# EAGLE design Mutli-Stepper-Driver (EAGLE 7.2.0)

## Sheet 1 of 5
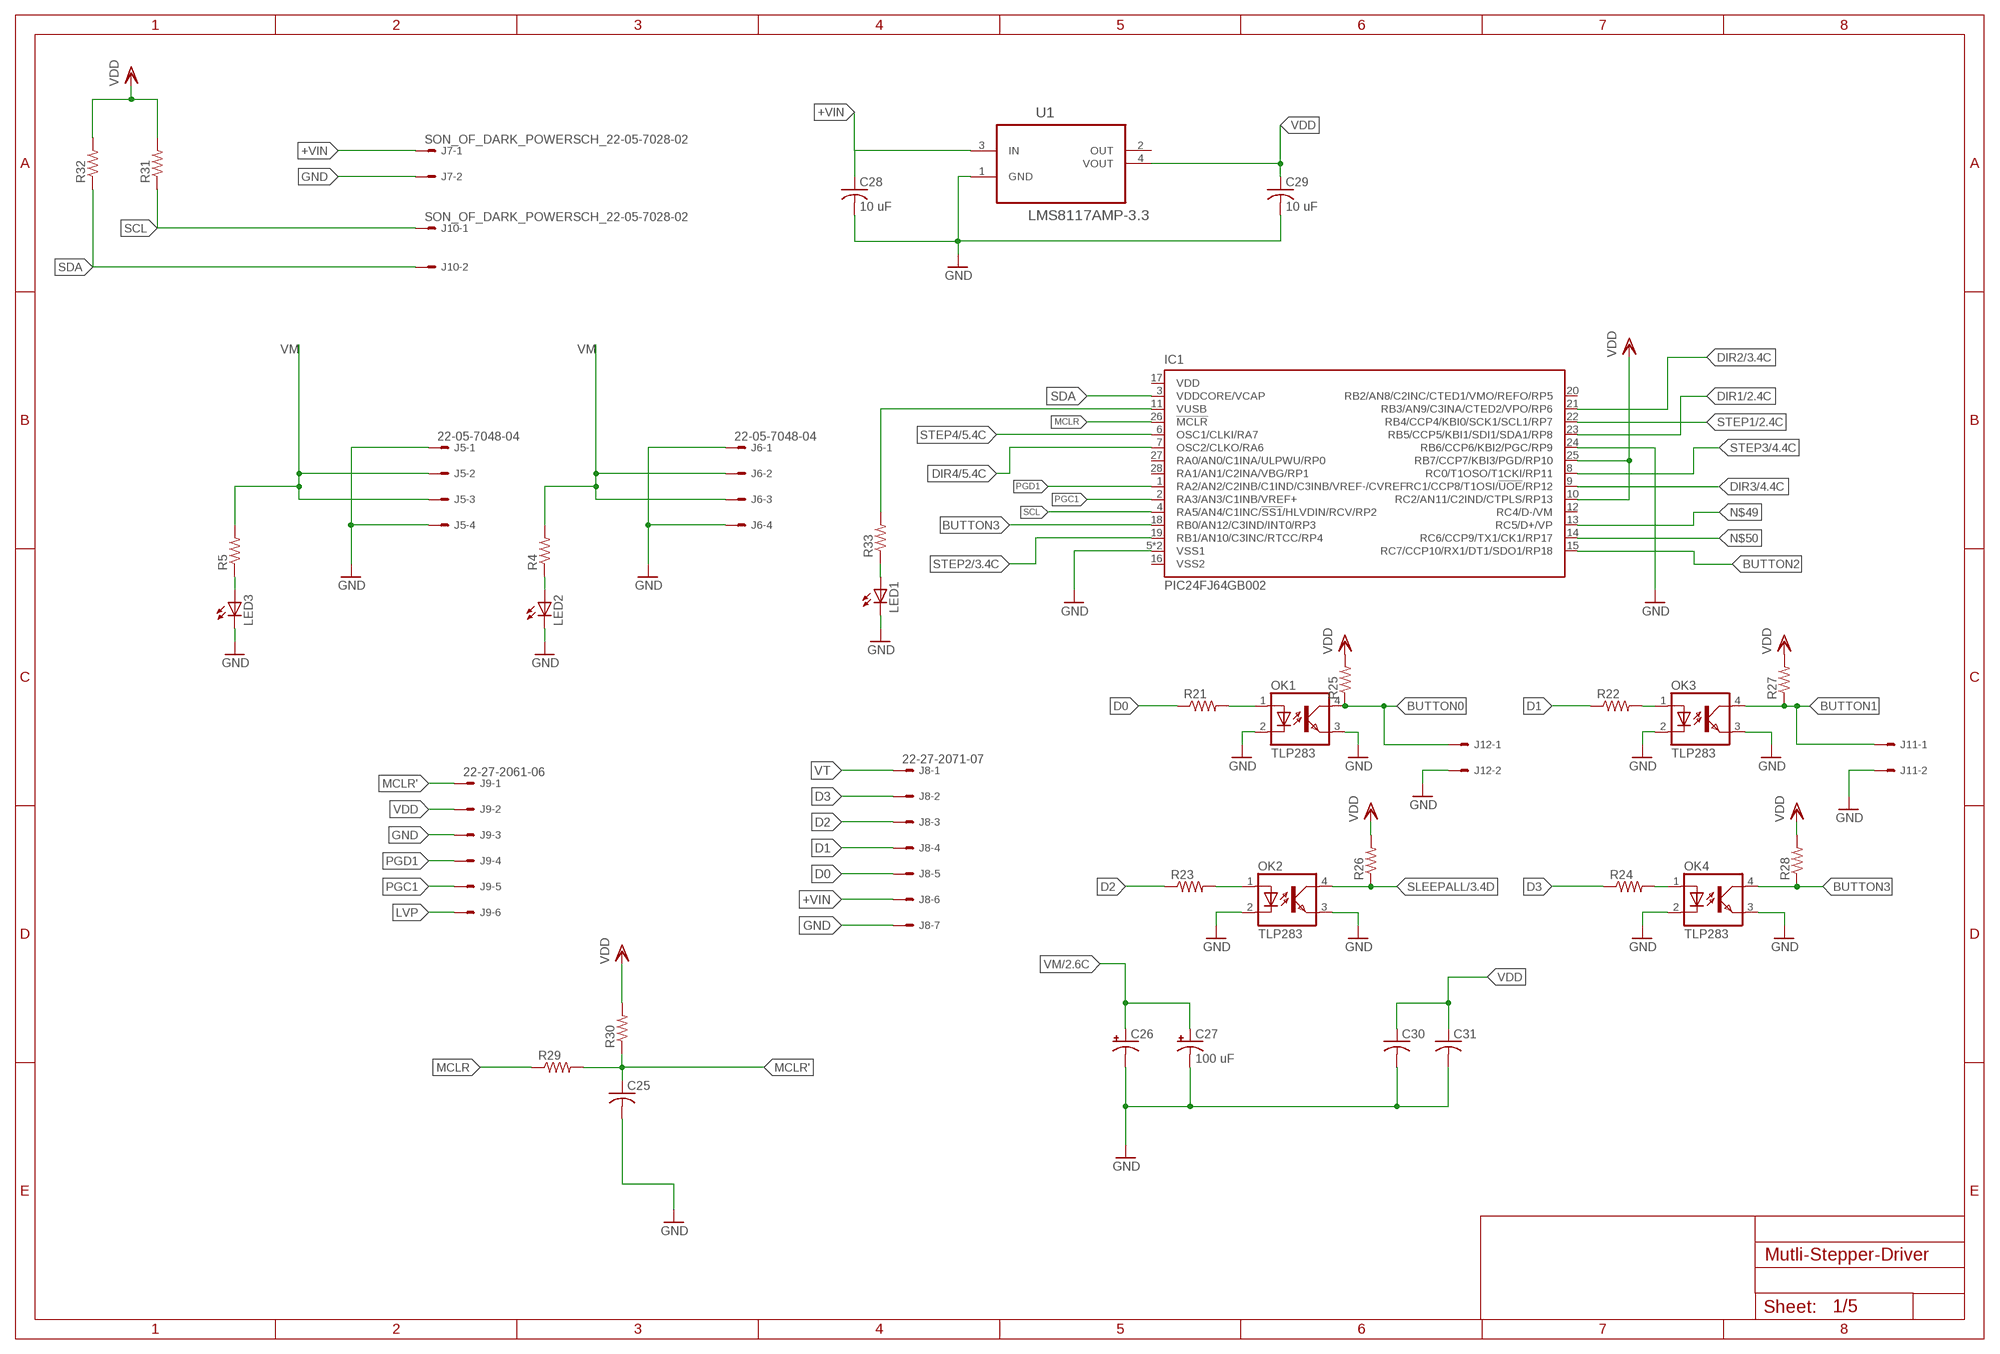
[diagram p0: schematic, sheet 1]

### Parts
C25  C-USC0805  [C0805]
C26  CPOL-USCT7343  [CT7343]
C27  100 uF  CPOL-USCT7343  [CT7343]
C28  10 uF  C-USC3216  [C3216]
C29  10 uF  C-USC3216  [C3216]
C30  C-USC0805  [C0805]
C31  C-USC0805  [C0805]
IC1  PIC24FJ64GB002  MICROCHIP_PIC18F2J53ML  [MICROCHIP_QFN28-ML_6X6MM]
J5  22-05-7048-04  [7395-04]
J6  22-05-7048-04  [7395-04]
J7  SON_OF_DARK_POWERSCH_22-05-7028-02  [SON_OF_DARK_POWERSCH_7395-02]
J8  22-27-2071-07  [6410-07]
J9  22-27-2061-06  [6410-06]
J10  SON_OF_DARK_POWERSCH_22-05-7028-02  [SON_OF_DARK_POWERSCH_7395-02]
J11  SON_OF_DARK_POWERSCH_22-05-7028-02  [SON_OF_DARK_POWERSCH_7395-02]
J12  SON_OF_DARK_POWERSCH_22-05-7028-02  [SON_OF_DARK_POWERSCH_7395-02]
LED1  LEDCHIPLED_0805  [CHIPLED_0805]
LED2  LEDCHIPLED_0805  [CHIPLED_0805]
LED3  LEDCHIPLED_0805  [CHIPLED_0805]
OK1  TLP283  [MINI-FLAT-4]
OK2  TLP283  [MINI-FLAT-4]
OK3  TLP283  [MINI-FLAT-4]
OK4  TLP283  [MINI-FLAT-4]
R4  R-US_R0805  [R0805]
R5  R-US_R0805  [R0805]
R21  R-US_R0805  [R0805]
R22  R-US_R0805  [R0805]
R23  R-US_R0805  [R0805]
R24  R-US_R0805  [R0805]
R25  R-US_R0805  [R0805]
R26  R-US_R0805  [R0805]
R27  R-US_R0805  [R0805]
R28  R-US_R0805  [R0805]
R29  R-US_R0805  [R0805]
R30  R-US_R0805  [R0805]
R31  R-US_R0805  [R0805]
R32  R-US_R0805  [R0805]
R33  R-US_R0805  [R0805]
U1  LMS8117AMP-3.3  NSC-LMS8117AMP_LMS8117AMP-3.3  [NSC-LMS8117AMP_SOT230P696X180-4N]

### Nets
+VIN: C28.1 J7.1 J8.6 U1.3(IN)
BUTTON0: J12.1 OK1.4(COL) R25.1
BUTTON1: J11.1 OK3.4(COL) R27.1
BUTTON2: IC1.15(RC7/CCP10/RX1/DT1/SDO1/RP18)
BUTTON3: IC1.18(RB0/AN12/C3IND/INT0/RP3) OK4.4(COL) R28.1
D0: J8.5 R21.1
D1: J8.4 R22.1
D2: J8.3 R23.1
D3: J8.2 R24.1
DIR1: IC1.23(RB5/CCP5/KBI1/SDI1/SDA1/RP8) ; also sheet 2
DIR2: IC1.21(RB3/AN9/C3INA/CTED2/VPO/RP6) ; also sheet 3
DIR3: IC1.9(RC1/CCP8/T1OSI/!UOE!/RP12) ; also sheet 4
DIR4: IC1.7(OSC2/CLKO/RA6) ; also sheet 5
GND: C25.2 C26.- C27.- C28.2 C29.2 C30.2 C31.2 IC1.5(VSS1) IC1.24(RB6/CCP6/KBI2/PGC/RP9) IC1.EXP(VSS1) J5.1 J5.4 J6.1 J6.4 J7.2 J8.7 J9.3 J11.2 J12.2 LED1.C LED2.C LED3.C OK1.2(C) OK1.3(EMIT) OK2.2(C) OK2.3(EMIT) OK3.2(C) OK3.3(EMIT) OK4.2(C) OK4.3(EMIT) U1.1(GND) ; also sheet 2,3,4,5
LVP: J9.6
MCLR: IC1.26(!MCLR) R29.1
MCLR': C25.1 J9.1 R29.2 R30.1
N$2: LED2.A R4.1
N$12: LED3.A R5.1
N$37: OK2.1(A) R23.2
N$40: OK4.1(A) R24.2
N$42: LED1.A R33.1
N$43: OK1.1(A) R21.2
N$47: OK3.1(A) R22.2
N$48: IC1.11(VUSB) R33.2
N$49: IC1.13(RC5/D+/VP)
N$50: IC1.14(RC6/CCP9/TX1/CK1/RP17)
PGC1: IC1.2(RA3/AN3/C1INB/VREF+) J9.5
PGD1: IC1.1(RA2/AN2/C2INB/C1IND/C3INB/VREF-/CVREF) J9.4
SCL: IC1.4(RA5/AN4/C1INC/!SS1!/HLVDIN/RCV/RP2) J10.1 R31.1
SDA: IC1.3(VDDCORE/VCAP) J10.2 R32.1
SLEEPALL: OK2.4(COL) R26.1 ; also sheet 2,3,4,5
STEP1: IC1.22(RB4/CCP4/KBI0/SCK1/SCL1/RP7) ; also sheet 2
STEP2: IC1.19(RB1/AN10/C3INC/RTCC/RP4) ; also sheet 3
STEP3: IC1.8(RC0/T1OSO/T1CKI/RP11) ; also sheet 4
STEP4: IC1.6(OSC1/CLKI/RA7) ; also sheet 5
VDD: C29.1 C30.1 C31.1 IC1.10(RC2/AN11/C2IND/CTPLS/RP13) IC1.25(RB7/CCP7/KBI3/PGD/RP10) J9.2 R25.2 R26.2 R27.2 R28.2 R30.2 R31.2 R32.2 U1.4(VOUT)
VM: C26.+ C27.+ J5.2 J5.3 J6.2 J6.3 R4.2 R5.2 ; also sheet 2,3,4,5
VT: J8.1
Unconnected: IC1.12(RC4/D-/VM) IC1.16(VSS2) IC1.17(VDD) IC1.20(RB2/AN8/C2INC/CTED1/VMO/REFO/RP5) IC1.27(RA0/AN0/C1INA/ULPWU/RP0) IC1.28(RA1/AN1/C2INA/VBG/RP1) U1.2(OUT)

## Sheet 2 of 5
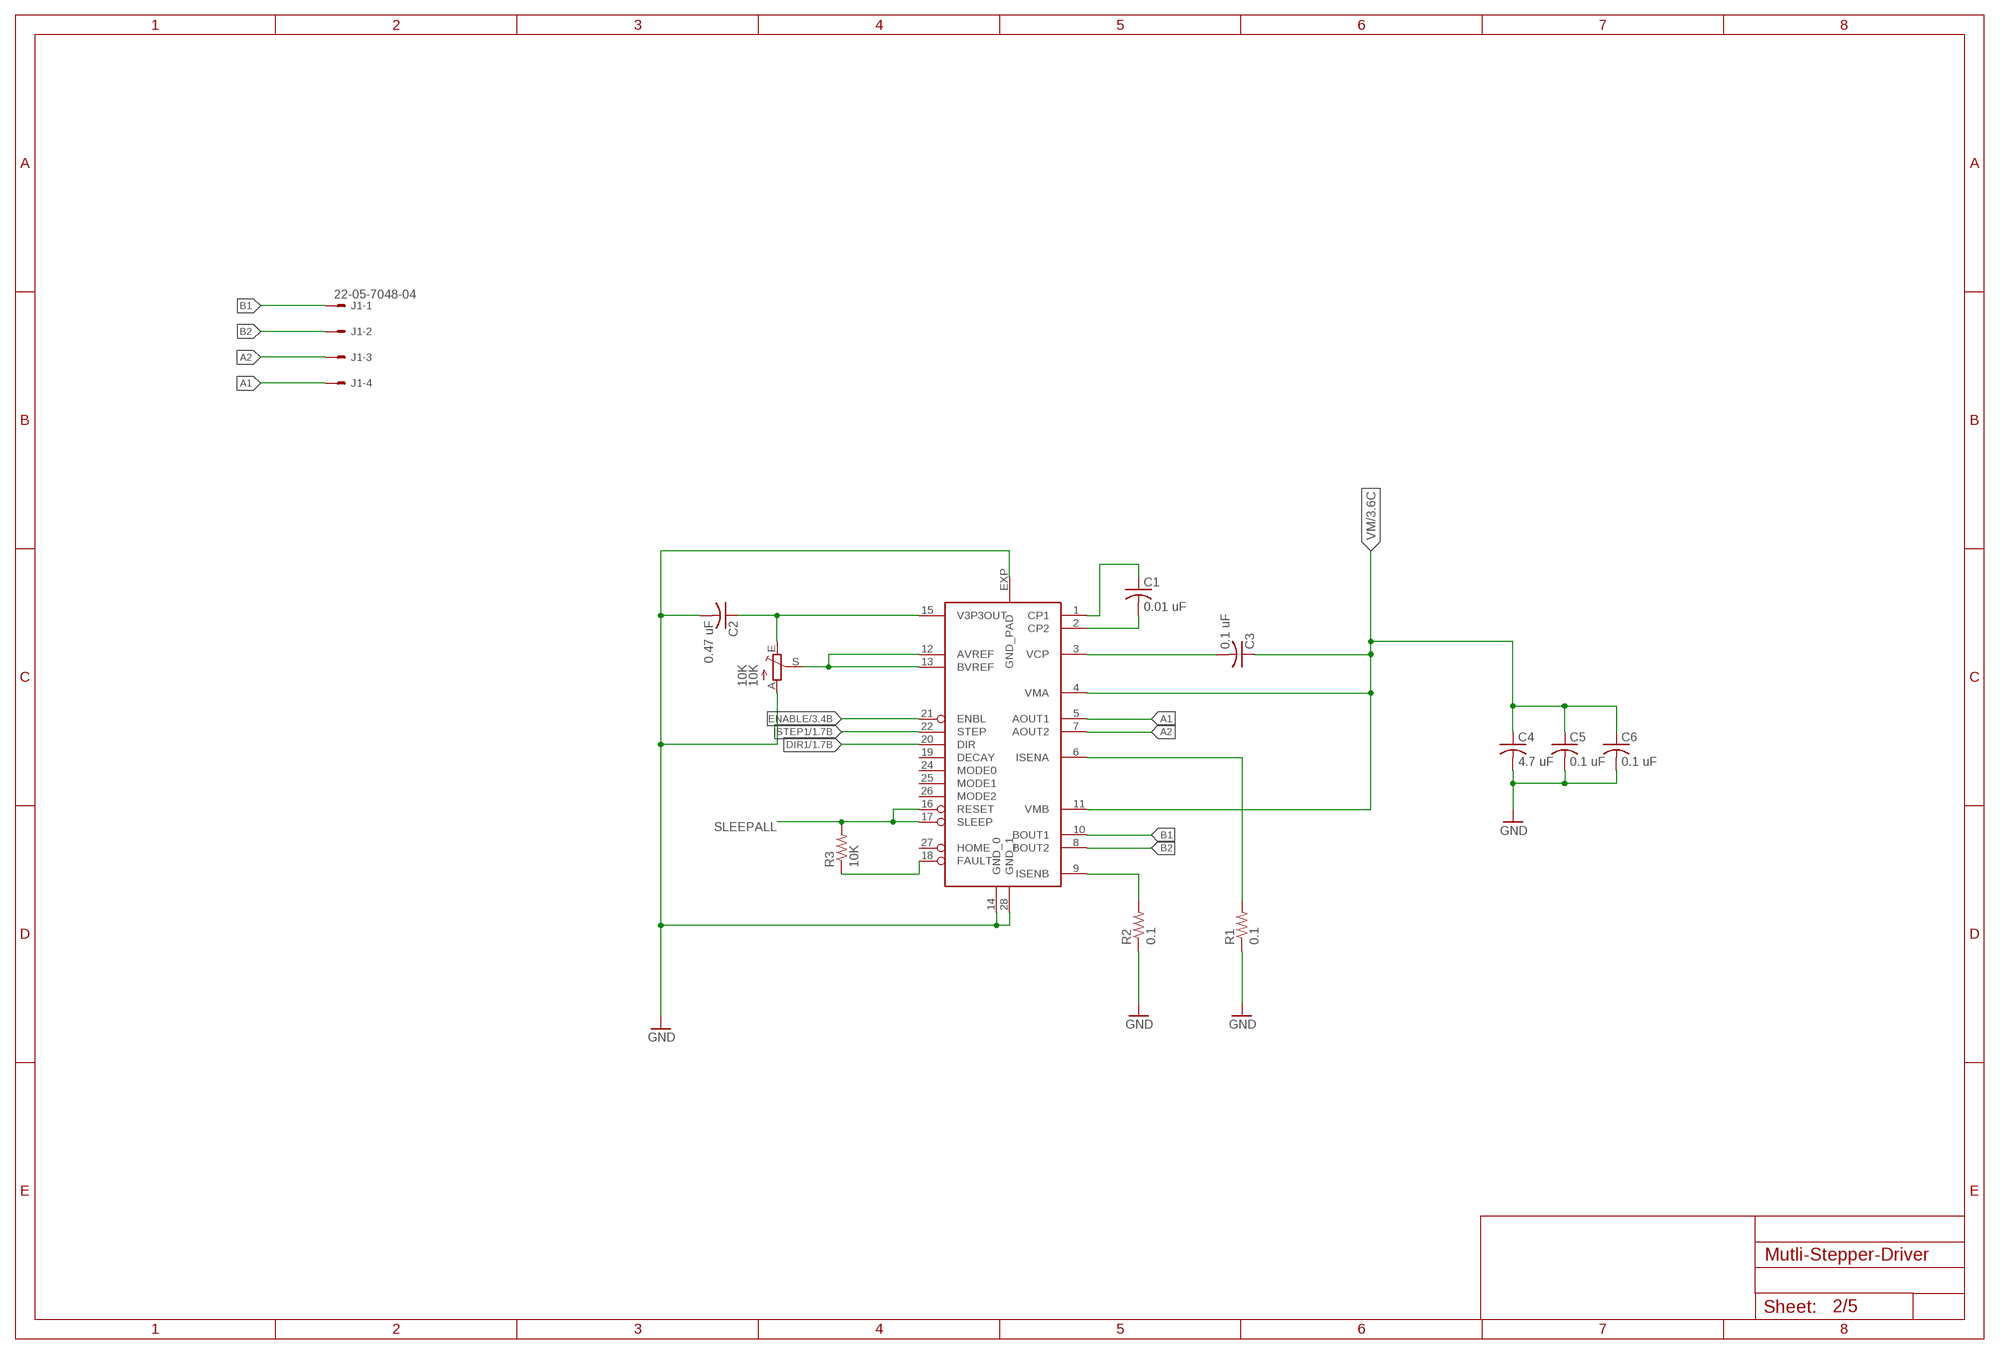
[diagram p1: schematic, sheet 2]

### Parts
10K  10K  TRIM_EU-CT6  [CT6]
C1  0.01 uF  C-USC0805  [C0805]
C2  0.47 uF  C-USC0805  [C0805]
C3  0.1 uF  C-USC0805  [C0805]
C4  4.7 uF  C-USC0805  [C0805]
C5  0.1 uF  C-USC0805  [C0805]
C6  0.1 uF  C-USC0805  [C0805]
J1  22-05-7048-04  [7395-04]
R1  0.1  R-US_R1206  [R1206]
R2  0.1  R-US_R1206  [R1206]
R3  10K  R-US_R0805  [R0805]
U$1  DRV8825PWP  [TSSOP-28]

### Nets
A1: J1.4 U$1.5(AOUT1)
A2: J1.3 U$1.7(AOUT2)
B1: J1.1 U$1.10(BOUT1)
B2: J1.2 U$1.8(BOUT2)
DIR1: U$1.20(DIR) ; also sheet 1
ENABLE: U$1.21(ENBL) ; also sheet 3,4,5
FAULT1: R3.1 U$1.18(FAULT)
GND: 10K.A C2.2 C4.2 C5.2 C6.2 R1.1 R2.1 U$1.14(GND_0) U$1.28(GND_1) U$1.EXP(GND_PAD) ; also sheet 1,3,4,5
N$1: C3.2 U$1.3(VCP)
N$9: R1.2 U$1.6(ISENA)
N$10: R2.2 U$1.9(ISENB)
N$11: 10K.S U$1.12(AVREF) U$1.13(BVREF)
N$15: 10K.E C2.1 U$1.15(V3P3OUT)
N$16: C1.1 U$1.1(CP1)
N$17: C1.2 U$1.2(CP2)
SLEEPALL: R3.2 U$1.16(RESET) U$1.17(SLEEP) ; also sheet 1,3,4,5
STEP1: U$1.22(STEP) ; also sheet 1
VM: C3.1 C4.1 C5.1 C6.1 U$1.4(VMA) U$1.11(VMB) ; also sheet 1,3,4,5
Unconnected: U$1.19(DECAY) U$1.24(MODE0) U$1.25(MODE1) U$1.26(MODE2) U$1.27(HOME)

## Sheet 3 of 5
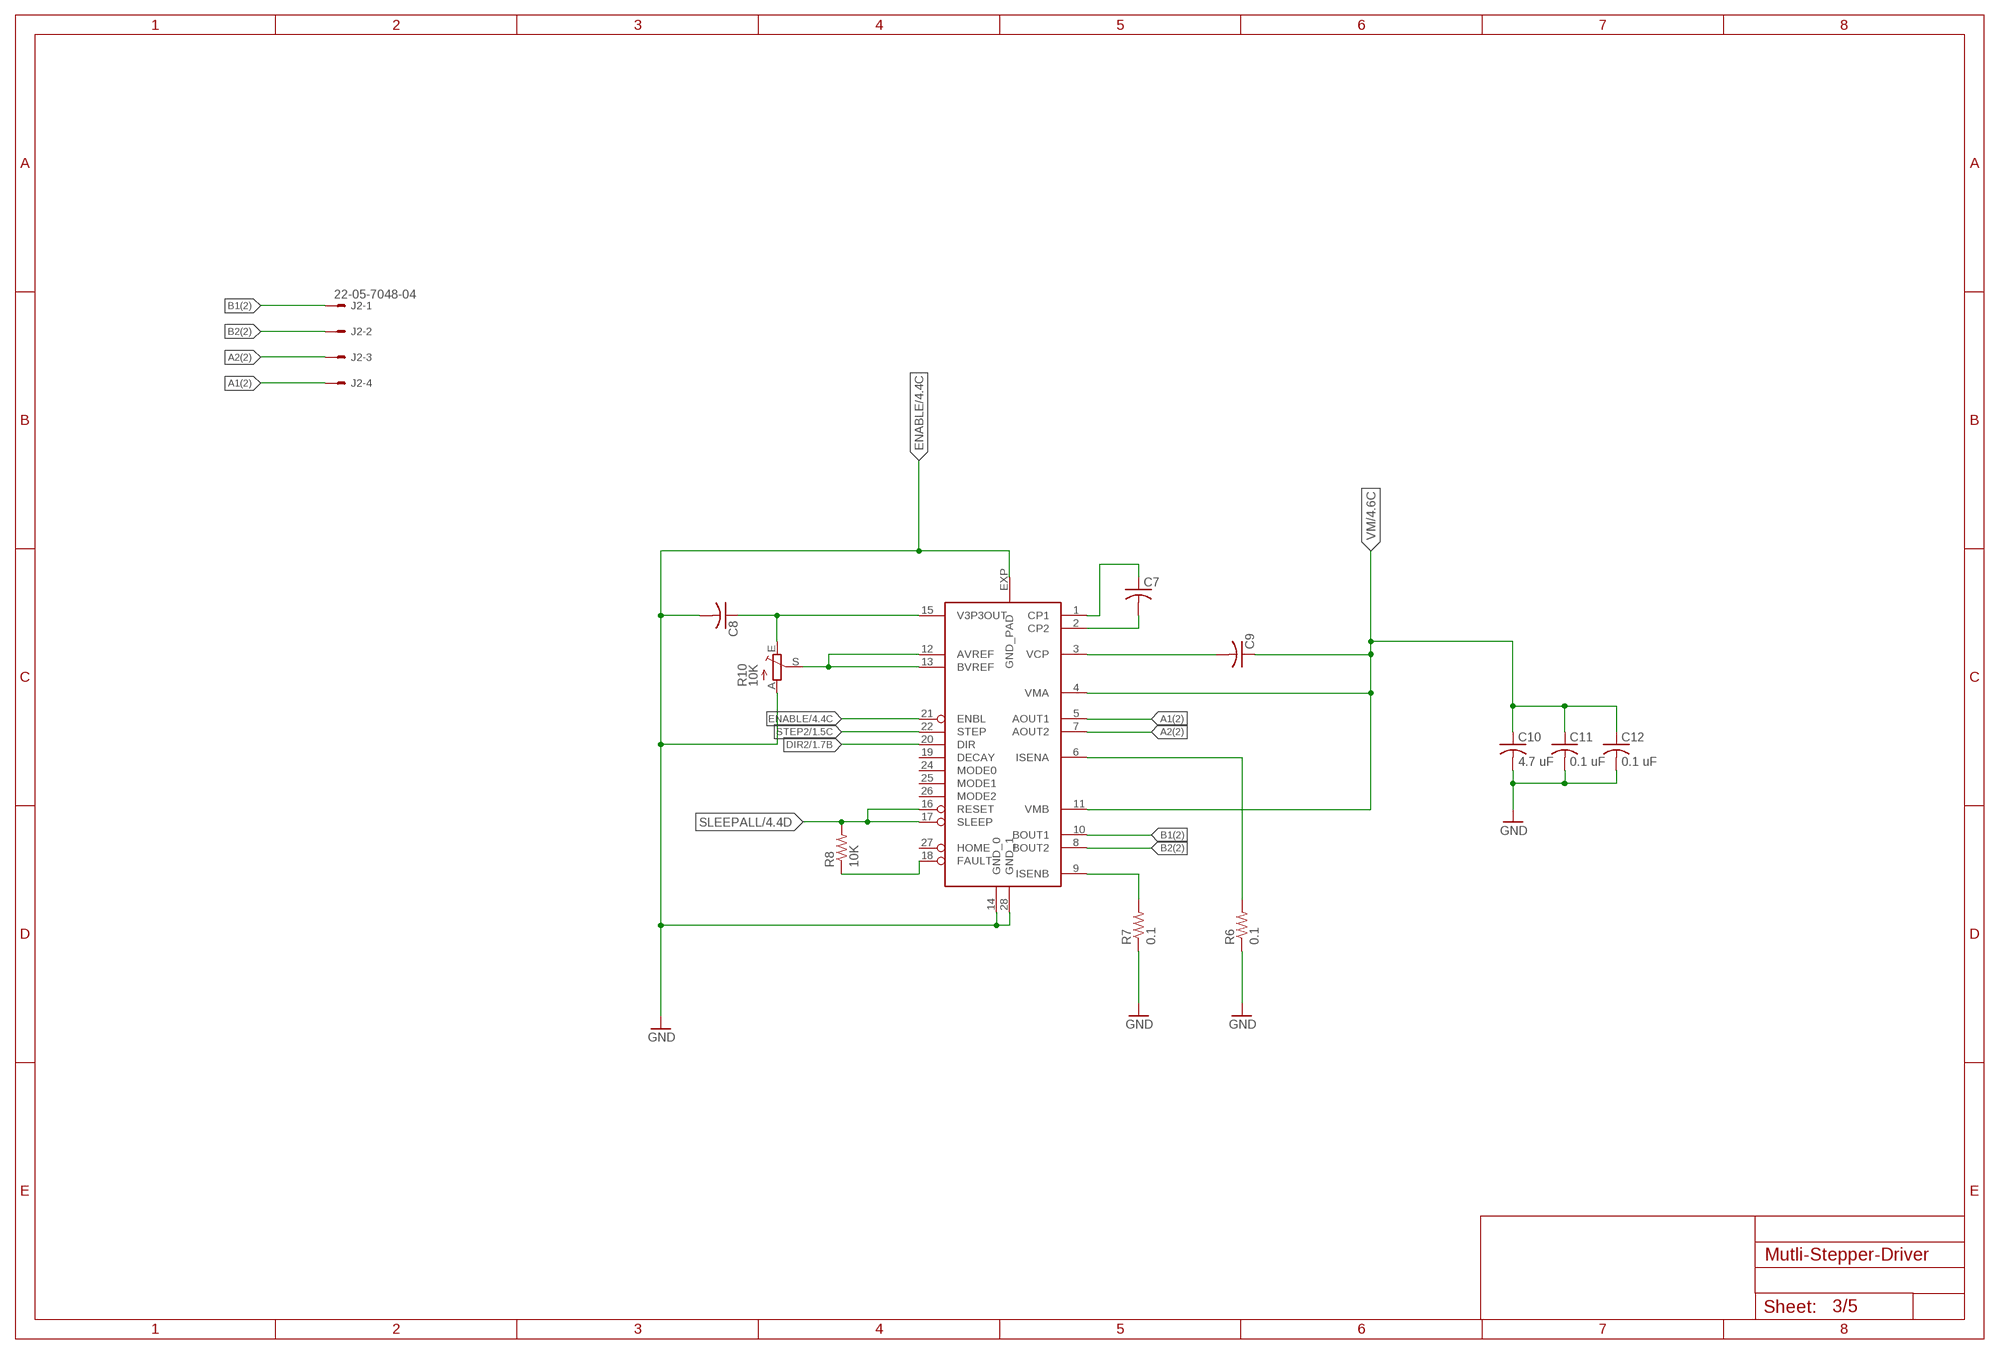
[diagram p2: schematic, sheet 3]

### Parts
C7  C-USC0805  [C0805]
C8  C-USC0805  [C0805]
C9  C-USC0805  [C0805]
C10  4.7 uF  C-USC0805  [C0805]
C11  0.1 uF  C-USC0805  [C0805]
C12  0.1 uF  C-USC0805  [C0805]
J2  22-05-7048-04  [7395-04]
R6  0.1  R-US_R1206  [R1206]
R7  0.1  R-US_R1206  [R1206]
R8  10K  R-US_R0805  [R0805]
R10  10K  TRIM_EU-CT6  [CT6]
U$2  DRV8825PWP  [TSSOP-28]

### Nets
A1(2): J2.4 U$2.5(AOUT1)
A2(2): J2.3 U$2.7(AOUT2)
B1(2): J2.1 U$2.10(BOUT1)
B2(2): J2.2 U$2.8(BOUT2)
DIR2: U$2.20(DIR) ; also sheet 1
ENABLE: C8.2 R10.A U$2.14(GND_0) U$2.21(ENBL) U$2.28(GND_1) U$2.EXP(GND_PAD) ; supply symbol labelled GND ; also sheet 2,4,5
FAULT2: R8.1 U$2.18(FAULT)
GND: C10.2 C11.2 C12.2 R6.1 R7.1 ; also sheet 1,2,4,5
N$3: R6.2 U$2.6(ISENA)
N$5: R7.2 U$2.9(ISENB)
N$6: C8.1 R10.E U$2.15(V3P3OUT)
N$7: C7.1 U$2.1(CP1)
N$8: C7.2 U$2.2(CP2)
N$14: C9.2 U$2.3(VCP)
N$18: R10.S U$2.12(AVREF) U$2.13(BVREF)
SLEEPALL: R8.2 U$2.16(RESET) U$2.17(SLEEP) ; also sheet 1,2,4,5
STEP2: U$2.22(STEP) ; also sheet 1
VM: C9.1 C10.1 C11.1 C12.1 U$2.4(VMA) U$2.11(VMB) ; also sheet 1,2,4,5
Unconnected: U$2.19(DECAY) U$2.24(MODE0) U$2.25(MODE1) U$2.26(MODE2) U$2.27(HOME)

## Sheet 4 of 5
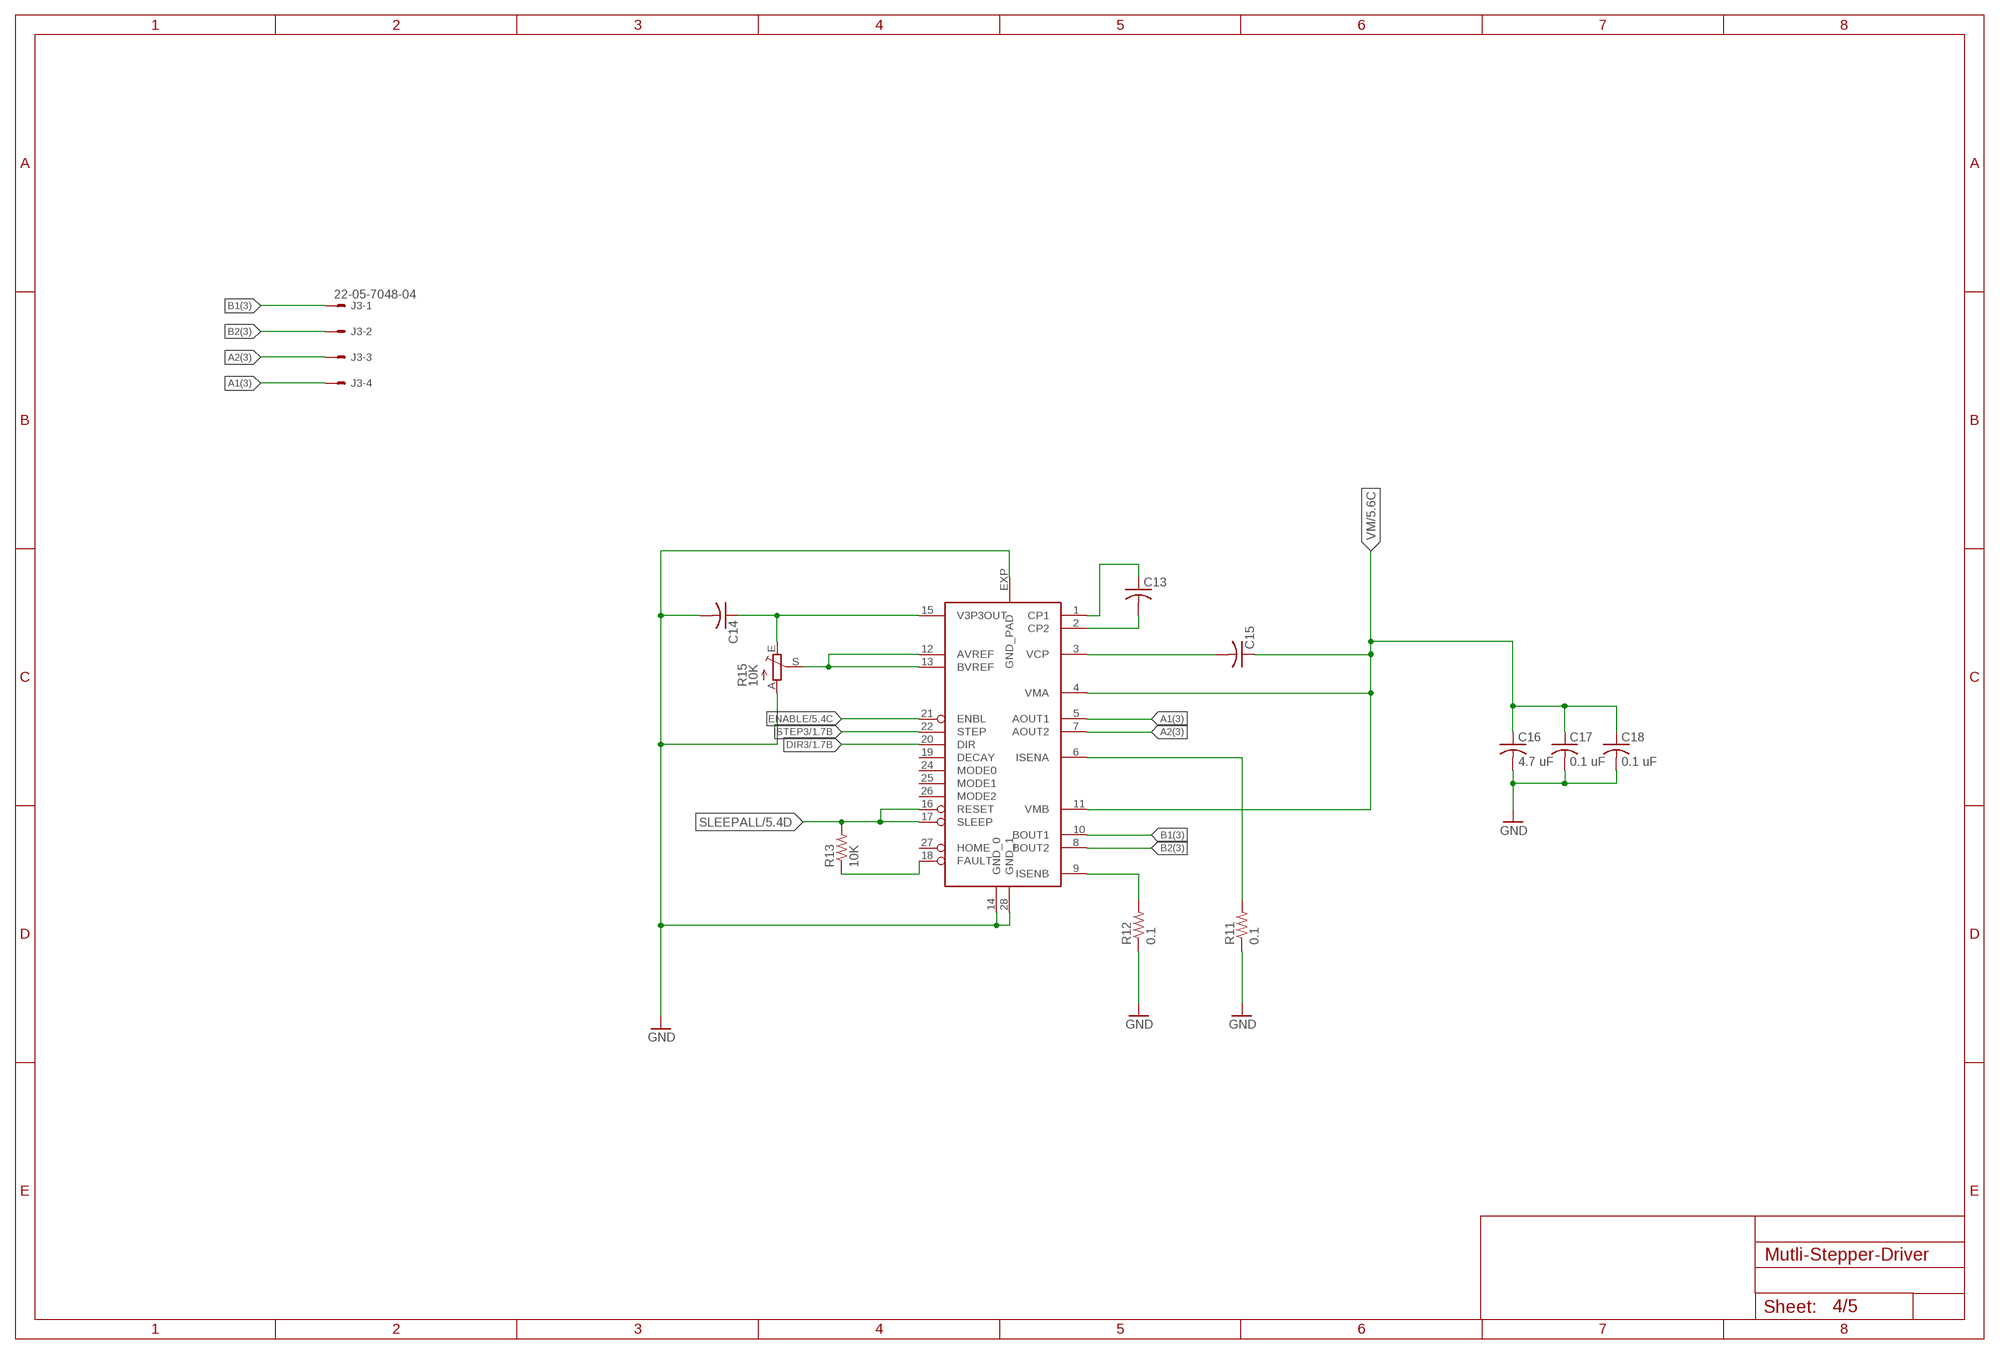
[diagram p3: schematic, sheet 4]

### Parts
C13  C-USC0805  [C0805]
C14  C-USC0805  [C0805]
C15  C-USC0805  [C0805]
C16  4.7 uF  C-USC0805  [C0805]
C17  0.1 uF  C-USC0805  [C0805]
C18  0.1 uF  C-USC0805  [C0805]
J3  22-05-7048-04  [7395-04]
R11  0.1  R-US_R1206  [R1206]
R12  0.1  R-US_R1206  [R1206]
R13  10K  R-US_R0805  [R0805]
R15  10K  TRIM_EU-CT6  [CT6]
U$3  DRV8825PWP  [TSSOP-28]

### Nets
A1(3): J3.4 U$3.5(AOUT1)
A2(3): J3.3 U$3.7(AOUT2)
B1(3): J3.1 U$3.10(BOUT1)
B2(3): J3.2 U$3.8(BOUT2)
DIR3: U$3.20(DIR) ; also sheet 1
ENABLE: U$3.21(ENBL) ; also sheet 2,3,5
FAULT3: R13.1 U$3.18(FAULT)
GND: C14.2 C16.2 C17.2 C18.2 R11.1 R12.1 R15.A U$3.14(GND_0) U$3.28(GND_1) U$3.EXP(GND_PAD) ; also sheet 1,2,3,5
N$19: R11.2 U$3.6(ISENA)
N$20: R12.2 U$3.9(ISENB)
N$21: C14.1 R15.E U$3.15(V3P3OUT)
N$22: C13.1 U$3.1(CP1)
N$23: C13.2 U$3.2(CP2)
N$26: C15.2 U$3.3(VCP)
N$27: R15.S U$3.12(AVREF) U$3.13(BVREF)
SLEEPALL: R13.2 U$3.16(RESET) U$3.17(SLEEP) ; also sheet 1,2,3,5
STEP3: U$3.22(STEP) ; also sheet 1
VM: C15.1 C16.1 C17.1 C18.1 U$3.4(VMA) U$3.11(VMB) ; also sheet 1,2,3,5
Unconnected: U$3.19(DECAY) U$3.24(MODE0) U$3.25(MODE1) U$3.26(MODE2) U$3.27(HOME)

## Sheet 5 of 5
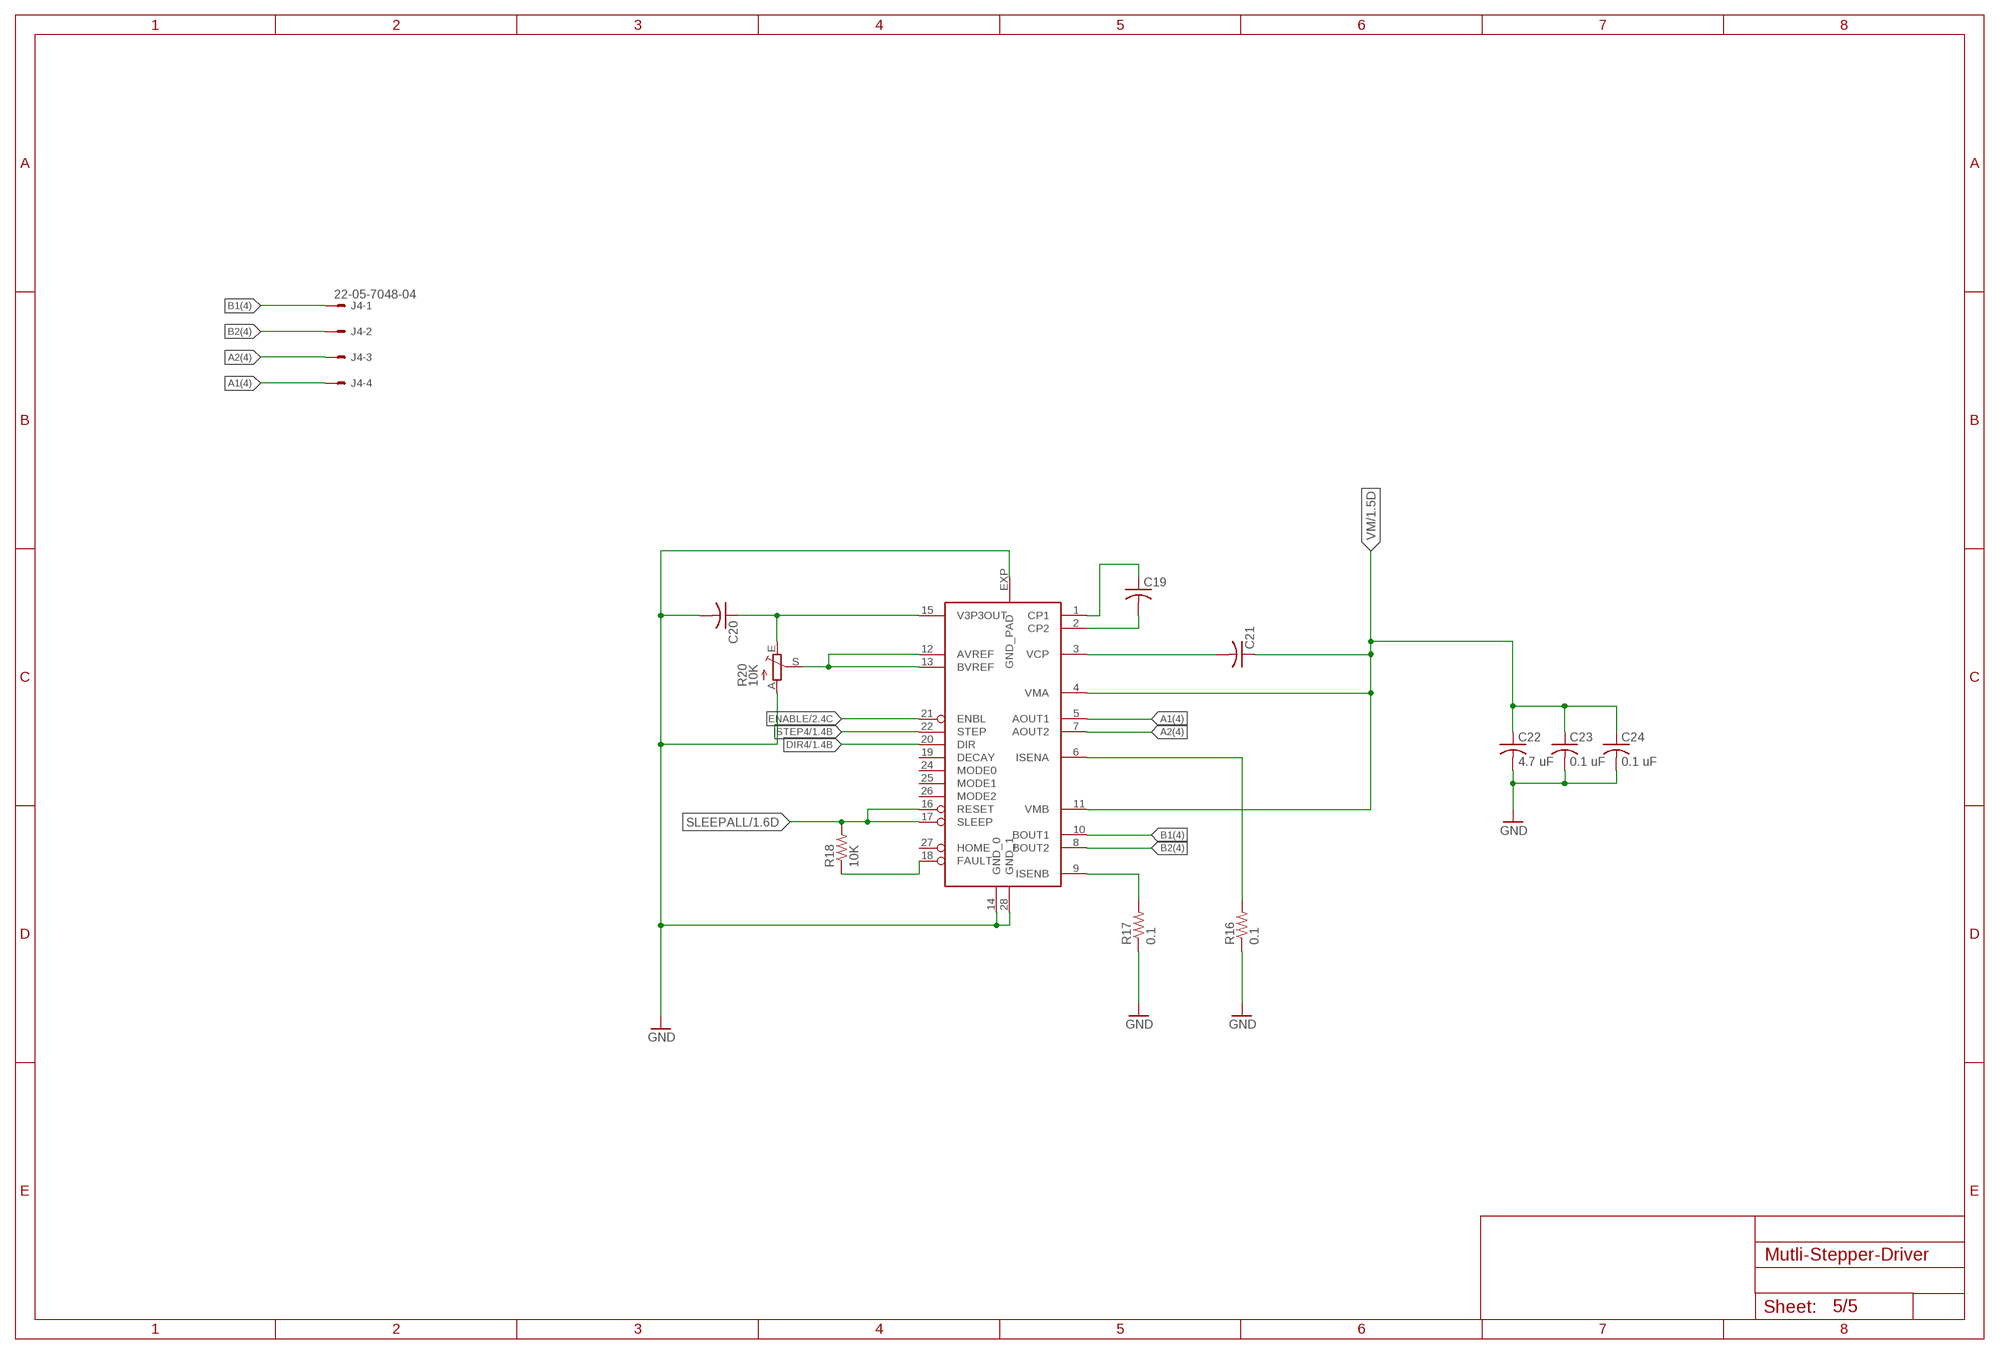
[diagram p4: schematic, sheet 5]

### Parts
C19  C-USC0805  [C0805]
C20  C-USC0805  [C0805]
C21  C-USC0805  [C0805]
C22  4.7 uF  C-USC0805  [C0805]
C23  0.1 uF  C-USC0805  [C0805]
C24  0.1 uF  C-USC0805  [C0805]
J4  22-05-7048-04  [7395-04]
R16  0.1  R-US_R1206  [R1206]
R17  0.1  R-US_R1206  [R1206]
R18  10K  R-US_R0805  [R0805]
R20  10K  TRIM_EU-CT6  [CT6]
U$4  DRV8825PWP  [TSSOP-28]

### Nets
A1(4): J4.4 U$4.5(AOUT1)
A2(4): J4.3 U$4.7(AOUT2)
B1(4): J4.1 U$4.10(BOUT1)
B2(4): J4.2 U$4.8(BOUT2)
DIR4: U$4.20(DIR) ; also sheet 1
ENABLE: U$4.21(ENBL) ; also sheet 2,3,4
FAULT4: R18.1 U$4.18(FAULT)
GND: C20.2 C22.2 C23.2 C24.2 R16.1 R17.1 R20.A U$4.14(GND_0) U$4.28(GND_1) U$4.EXP(GND_PAD) ; also sheet 1,2,3,4
N$28: R16.2 U$4.6(ISENA)
N$29: R17.2 U$4.9(ISENB)
N$30: C20.1 R20.E U$4.15(V3P3OUT)
N$31: C19.1 U$4.1(CP1)
N$32: C19.2 U$4.2(CP2)
N$35: C21.2 U$4.3(VCP)
N$36: R20.S U$4.12(AVREF) U$4.13(BVREF)
SLEEPALL: R18.2 U$4.16(RESET) U$4.17(SLEEP) ; also sheet 1,2,3,4
STEP4: U$4.22(STEP) ; also sheet 1
VM: C21.1 C22.1 C23.1 C24.1 U$4.4(VMA) U$4.11(VMB) ; also sheet 1,2,3,4
Unconnected: U$4.19(DECAY) U$4.24(MODE0) U$4.25(MODE1) U$4.26(MODE2) U$4.27(HOME)

## Library data of the parts
10K R10 R15 R20 = pot:TRIM_EU-: POTENTIOMETER
C1-C25 C28-C31 = rcl:C-US: CAPACITOR, American symbol
C26 C27 = rcl:CPOL-US: POLARIZED CAPACITOR, American symbol
IC1 = MotherboardRev2:MICROCHIP_PIC18F2*J53: PIC18F47J53 Family High-Performance USB Microcontrollers with nanoWatt XLP Technology Source: Data sheet <http://ww1.microchip.com/downloads/en/DeviceDoc/39964B.pdf>
J1-J6 = Son_of_Dark_Power:22-?-04: CONNECTOR wire to board 2.54 mm (.1 inch) pitch header; OC_FARNELL: unknown; OC_NEWARK: unknown
J7 J10-J12 = MotherboardRev2:SON_OF_DARK_POWERSCH_22-?-02: CONNECTOR wire to board 2.54 mm (.1 inch) pitch header; OC_FARNELL: 9731601; OC_NEWARK: unknown
J8 = con-molex:22-?-07: CONNECTOR wire to board 2.54 mm (.1 inch) pitch header; OC_FARNELL: unknown; OC_NEWARK: unknown
J9 = con-molex:22-?-06: CONNECTOR wire to board 2.54 mm (.1 inch) pitch header; OC_FARNELL: unknown; OC_NEWARK: unknown
LED1-LED3 = led:LED: LED OSRAM: - CHIPLED LG R971, LG N971, LY N971, LG Q971, LY Q971, LO R971, LY R971 LH N974, LH R974 LS Q976, LO Q976, LY Q976 LO Q996 - Hyper CHIPLED LW Q18S LB Q993, LB Q99A, LB R99A - SideLED LS A670, LO A670, LY A670, LG A670, LP A670 LB A673, LV A673, LT A673, LW A673 LH A674 LY A675 LS A676, LA A676, LO A676, LY A676, LW A676 LS A679, LY A679, LG A679 - Hyper Micro SIDELED® LS Y876, LA Y876, LO Y876, LY Y876 LT Y87S - SmartLED LW L88C, LW L88S LB L89C, LB L89S, LG L890 LS L89K, LO L89K, LY L89K LS L896, LA L896, LO L896, LY L896 - TOPLED LS T670, LO T670, LY T670, LG T670, LP T670 LSG T670, LSP T670, LSY T670, LOP T670, LYG T670 LG T671, LOG T671, LSG T671 LB T673, LV T673, LT T673, LW T673 LH T674 LS T676, LA T676, LO T676, LY T676, LB T676, LH T676, LSB T676, LW T676 LB T67C, LV T67C, LT T67C, LS T67K, LO T67K, LY T67K, LW E67C LS E67B, LA E67B, LO E67B, LY E67B, LB E67C, LV E67C, LT E67C LW T67C LS T679, LY T679, LG T679 LS T770, LO T770, LY T770, LG T770, LP T770 LB T773, LV T773, LT T773, LW T773 LH T774 LS E675, LA E675, LY E675, LS T675 LS T776, LA T776, LO T776, LY T776, LB T776 LHGB T686 LT T68C, LB T68C - Hyper Mini TOPLED® LB M676 - Mini TOPLED Santana® LG M470 LS M47K, LO M47K, LY M47K Source: http://www.osram.convergy.de LUXEON: - LUMILED® LXK2-PW12-R00, LXK2-PW12-S00, LXK2-PW14-U00, LXK2-PW14-V00 LXK2-PM12-R00, LXK2-PM12-S00, LXK2-PM14-U00 LXK2-PE12-Q00, LXK2-PE12-R00, LXK2-PE12-S00, LXK2-PE14-T00, LXK2-PE14-U00 LXK2-PB12-K00, LXK2-PB12-L00, LXK2-PB12-M00, LXK2-PB14-N00, LXK2-PB14-P00, LXK2-PB14-Q00 LXK2-PR12-L00, LXK2-PR12-M00, LXK2-PR14-Q00, LXK2-PR14-R00 LXK2-PD12-Q00, LXK2-PD12-R00, LXK2-PD12-S00 LXK2-PH12-R00, LXK2-PH12-S00 LXK2-PL12-P00, LXK2-PL12-Q00, LXK2-PL12-R00 Source: www.luxeon.com KINGBRIGHT: KA-3528ASYC Source: www.kingbright.com
OK1-OK4 = optocoupler:TLP283: TOSHIBA PHOTOCOUPLER GaAs IRED & PHOTO-TRANSISTOR Source: http://www.semicon.toshiba.co.jp/td/en/Opto/Photocoupler/en_20050928_TLP283_datasheet.pdf; OC_FARNELL: unknown; OC_NEWARK: unknown
R1-R8 R11-R13 R16-R18 R21-R33 = rcl:R-US_: RESISTOR, American symbol
U1 = MotherboardRev2:NSC-LMS8117AMP_LMS8117AMP-3.3: Low-Dropout Linear Regulator; MPN: LMS8117AMP-3.3; OC_FARNELL: 1469032; OC_NEWARK: 41K3020; PACKAGE: SOT-223-3; SUPPLIER: National Semiconductor
U$1-U$4 = drv88xx:DRV8825PWP

## Board
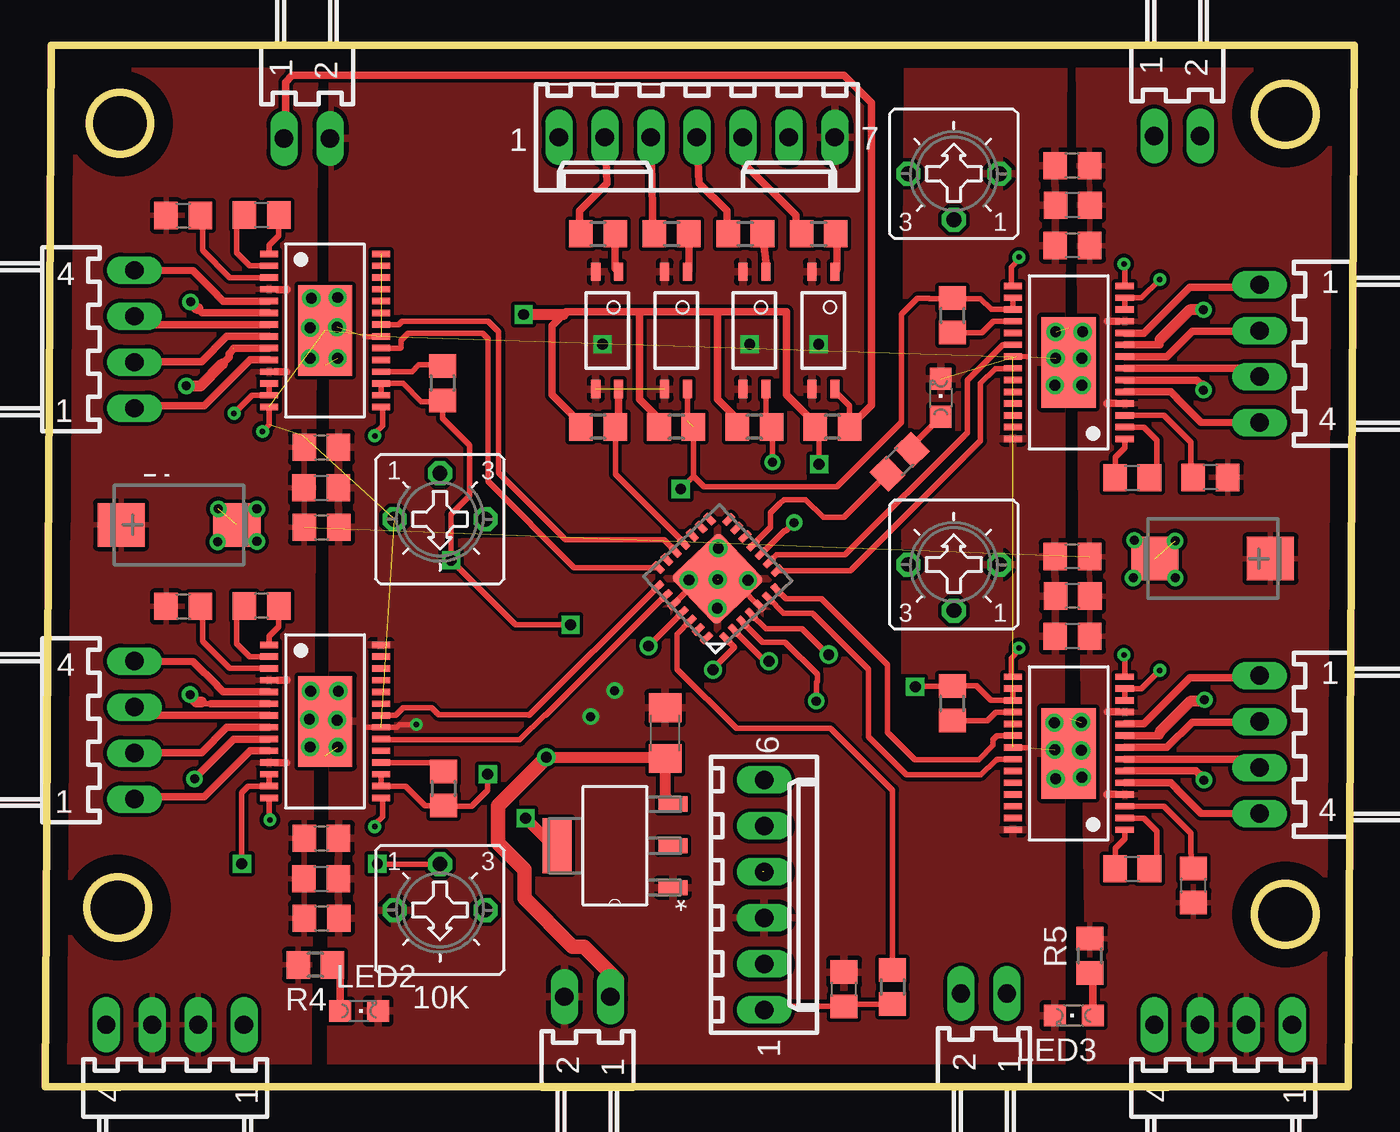
[diagram p5: board, top side]
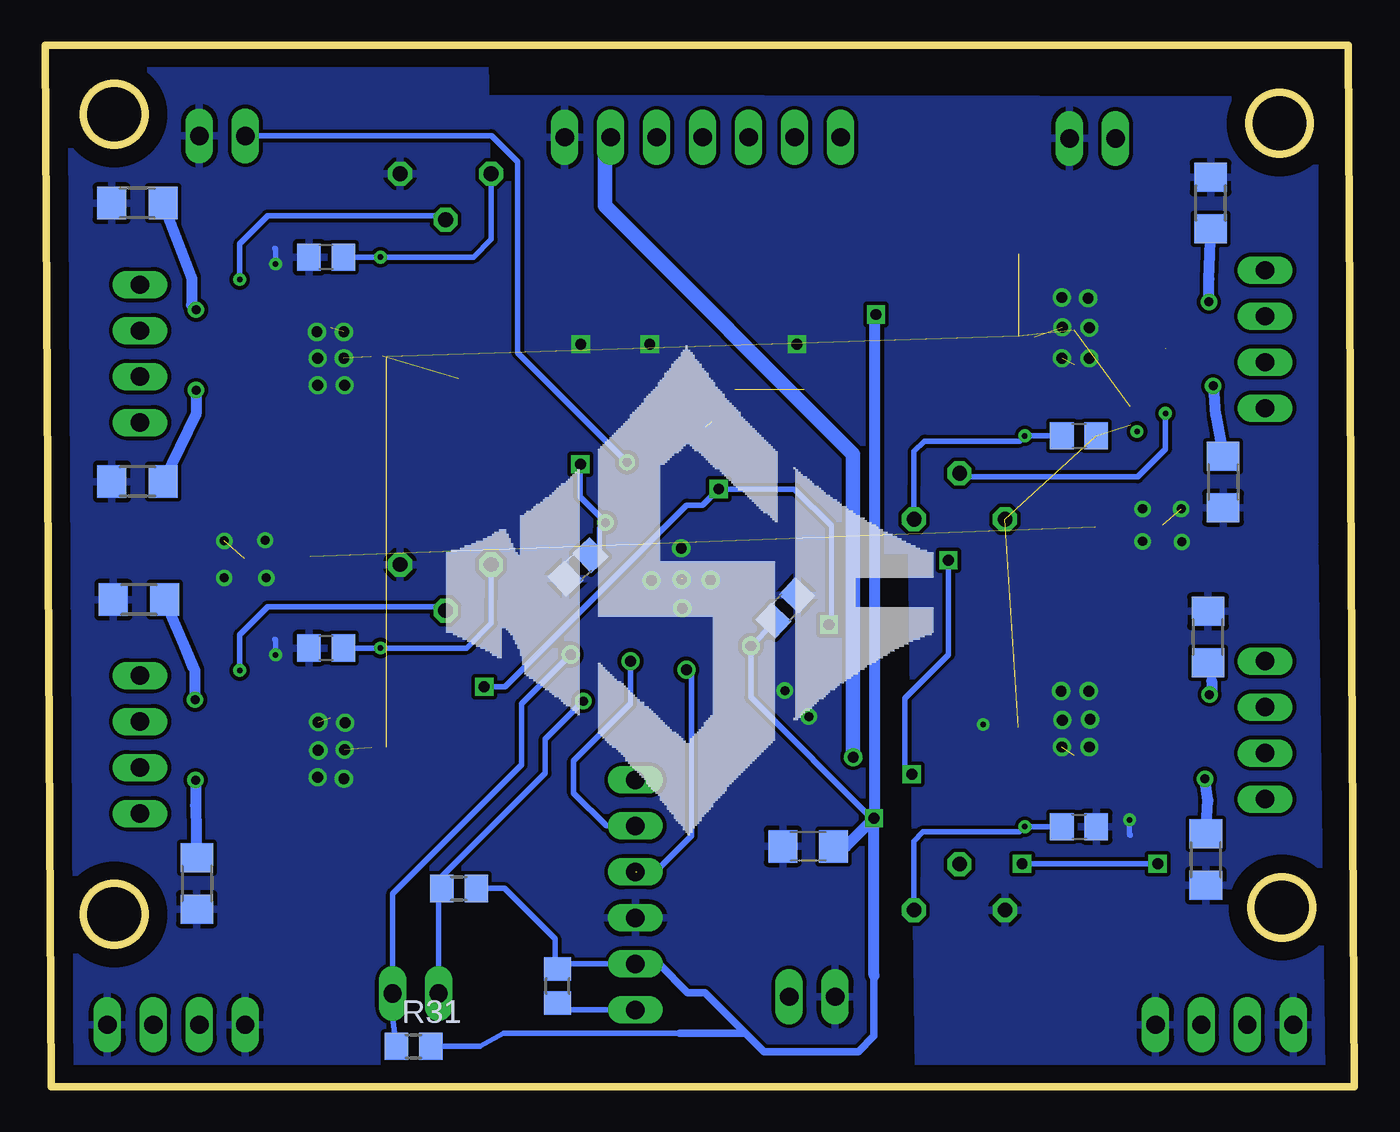
[diagram p6: board, bottom side, seen from below]

Size 72.33 x 57.52 mm. Coordinates in mm from the lower left corner, seen from the top.
Outline: 0,0 0.32,57.52 72.33,57.52 72.01,0 0,0
Outline: circle at 4,9.89 radius 1.7
Outline: circle at 68.52,9.51 radius 1.7
Outline: circle at 68.52,53.71 radius 1.7
Outline: circle at 4.13,53.2 radius 1.7
Copper layers (1*16): Top 0.035mm / dielectric 1.5mm / Bottom 0.035mm
Design rules "default": minimum track width 10mil, minimum drill 24mil, track to track 8mil, track to pad 8mil, pad to pad 8mil, via to via 8mil, smd to smd 8mil, copper to edge 40mil, drill to drill 8mil, minimum pad ring 10mil, minimum via ring 8mil, stop-mask expansion 4mil, vias tented up to drill 0mil, thermal gap 10mil

### Footprints (pad centres in the part's own frame; a part is rotated, then mirrored left to right if it is on the bottom)
CT6 = drill 0.813 octagon: A 2.515,0; E -2.515,0; S 0,-2.54
C0805 = smd 1.3 x 1.5: 1 -0.95,0; 2 0.95,0
CT7343 = smd 2.6 x 2.4: + -3.2,0; - 3.2,0
C3216 = smd 1.6 x 1.8: 1 -1.4,0; 2 1.4,0
MICROCHIP_QFN28-ML_6X6MM = smd 0.7 x 0.35: 1 -2.7,1.95; 2 -2.7,1.3; 3 -2.7,0.65; 4 -2.7,0; 5 -2.7,-0.65; 6 -2.7,-1.3; 7 -2.7,-1.95; 15 2.7,-1.95; 16 2.7,-1.3; 17 2.7,-0.65; 18 2.7,0; 19 2.7,0.65; 20 2.7,1.3; 21 2.7,1.95 | smd 0.35 x 0.7: 8 -1.95,-2.7; 9 -1.3,-2.7; 10 -0.65,-2.7; 11 0,-2.7; 12 0.65,-2.7; 13 1.3,-2.7; 14 1.95,-2.7; 22 1.95,2.7; 23 1.3,2.7; 24 0.65,2.7; 25 0,2.7; 26 -0.65,2.7; 27 -1.3,2.7; 28 -1.95,2.7 | smd 3.7 x 3.7: EXP 0,0
7395-04 = drill 1.016 long: 1 3.81,0; 2 1.27,0; 3 -1.27,0; 4 -3.81,0
SON_OF_DARK_POWERSCH_7395-02 = drill 1.016 long: 1 1.27,0; 2 -1.27,0
6410-07 = drill 1.016 long: 1 7.62,0; 2 5.08,0; 3 2.54,0; 4 0,0; 5 -2.54,0; 6 -5.08,0; 7 -7.62,0
6410-06 = drill 1.016 long: 1 6.35,0; 2 3.81,0; 3 1.27,0; 4 -1.27,0; 5 -3.81,0; 6 -6.35,0
CHIPLED_0805 = smd 1.2 x 1.2: A 0,-1.05; C 0,1.05
MINI-FLAT-4 = smd 1 x 0.5: 1 -3.24,0.635; 2 -3.24,-0.635; 3 3.24,-0.635; 4 3.24,0.635
R1206 = smd 1.6 x 1.803: 1 -1.422,0; 2 1.422,0
R0805 = smd 1.3 x 1.5: 1 -0.95,0; 2 0.95,0
NSC-LMS8117AMP_SOT230P696X180-4N = smd 1.6 x 0.838: 1 -3.2,2.311; 2 -3.2,0; 3 -3.2,-2.311 | smd 1.6 x 3.023: 4 3.2,0
TSSOP-28 = smd 0.35 x 1: 1 -4.225,-3.087; 2 -3.575,-3.087; 3 -2.925,-3.087; 4 -2.275,-3.087; 5 -1.625,-3.087; 6 -0.975,-3.087; 7 -0.325,-3.087; 8 0.325,-3.087; 9 0.975,-3.087; 10 1.625,-3.087; 11 2.275,-3.087; 12 2.925,-3.087; 13 3.575,-3.087; 14 4.225,-3.087; 15 4.225,3.087; 16 3.575,3.087; 17 2.925,3.087; 18 2.275,3.087; 19 1.625,3.087; 20 0.975,3.087; 21 0.325,3.087; 22 -0.325,3.087; 23 -0.975,3.087; 24 -1.625,3.087; 25 -2.275,3.087; 26 -2.925,3.087; 27 -3.575,3.087; 28 -4.225,3.087 | smd 5 x 3: EXP 0,0

### Placement (x,y rotation side)
10K  21.81,9.75 180 top
C1  11.96,26.55 180 top
C2  [C0805]  15.21,14.36 0 bottom
C3  7.63,26.53 0 top
C4  15.24,11.48 0 top
C5  15.27,9.3 0 top
C6  15.26,13.72 0 top
C7  11.96,48.14 180 top
C8  15.21,35.95 0 bottom
C9  7.63,48.12 0 top
C10  15.24,33.07 0 top
C11  15.27,30.89 0 top
C12  15.26,35.31 0 top
C13  60.06,33.62 0 top
C14  56.81,45.81 180 bottom
C15  64.38,33.65 180 top
C16  56.77,48.69 180 top
C17  56.75,50.87 180 top
C18  56.76,46.46 180 top
C19  60.06,12.03 0 top
C20  56.81,24.22 180 bottom
C21  63.44,11.11 90 top
C22  56.77,27.1 180 top
C23  56.75,29.28 180 top
C24  56.76,24.87 180 top
C25  44.14,5.38 90 top
C26  64.5,29.16 180 top
C27  7.39,31.03 0 top
C28  34.26,19.52 90 top
C29  30.17,13.27 180 bottom
C30  42.89,28.71 223.4 bottom
C31  31.45,26.44 47.2 bottom
IC1  37.15,28.05 133.5 top
J1  4.92,19.69 270 top
J2  4.92,41.28 270 top
J3  67.09,40.48 90 top
J4  67.09,18.89 90 top
J5  7.18,3.42 0 top
J6  65.09,3.42 0 top
J7  29.95,4.96 0 top
J8  36.01,52.44 180 top
J9  39.72,10.59 270 top
J10  51.86,5.14 0 top
J11  62.54,52.52 180 top
J12  14.46,52.37 180 top
LED1  49.48,38.04 0 top
LED2  17.34,4.18 270 top
LED3  56.84,3.92 90 top
OK1  42.99,41.77 270 top
OK2  34.86,41.77 270 top
OK3  39.18,41.77 270 top
OK4  31.05,41.77 270 top
R1  8.08,24.83 270 bottom
R2  8.21,12.53 90 bottom
R3  22.01,16.47 270 top
R4  14.92,6.72 180 top
R5  57.72,7.23 90 top
R6  7.94,48.8 270 bottom
R7  7.25,33.4 90 bottom
R8  21.95,38.86 270 top
R10  21.81,31.34 180 top
R11  67.23,33.42 0 bottom
R12  67.24,48.8 0 bottom
R13  50.13,42.6 90 top
R15  50.2,50.42 0 top
R16  63.95,11.23 90 bottom
R17  67.15,26.9 0 bottom
R18  50.12,21.17 90 top
R20  50.2,28.83 0 top
R21  42.74,47.1 0 top
R22  38.68,47.1 0 top
R23  34.61,47.1 0 top
R24  30.55,47.1 0 top
R25  43.5,36.44 180 top
R26  34.86,36.44 180 top
R27  39.18,36.44 180 top
R28  30.55,36.44 180 top
R29  46.81,5.5 270 top
R30  44.02,5.56 90 bottom
R31  51.98,2.22 0 bottom
R32  49.47,10.95 0 bottom
R33  47.21,34.52 224.1 top
U1  31.47,13.3 180 top
U$1  15.46,20.17 270 top
U$2  15.46,41.76 270 top
U$3  56.55,40 90 top
U$4  56.55,18.41 90 top

### Tracks (layer width: path | path; a pad name or v marks a point on that pad's centre or on a via)
+VIN  (via drill 0.6)
  Top 0.61: U1.3 34.26,16.03 C28.1 34.18,18.2 v27.69,18.2
  Top 0.813: J7.1 31.6,4.88 31.6,5.91 29.78,7.73 29.15,7.73 26.48,10.4 26.48,11.96 25.02,13.43 25.02,15.52 v27.69,18.2
  Bottom 0.813: v27.69,18.2 27.69,34.93 41.41,48.65 41.41,51.48 J8.6
A1
  Top 0.406: U$1.5 9.83,21.8 9.49,22.13 9.49,22.15 8.17,23.47 J1.4
A1(2)
  Top 0.406: U$2.5 9.83,43.39 9.49,43.72 9.49,43.74 8.17,45.06 J2.4
A1(3)
  Top 0.406: U$3.5 62.19,38.37 62.52,38.04 62.52,38.02 63.84,36.7 J3.4
A1(4)
  Top 0.406: U$4.5 62.19,16.78 62.52,16.45 62.52,16.43 63.84,15.11 J4.4
A2
  Top 0.406: U$1.7 5.38,20.5 J1.3
A2(2)
  Top 0.406: U$2.7 5.38,42.09 J2.3
A2(3)
  Top 0.406: U$3.7 66.63,39.67 J3.3
A2(4)
  Top 0.406: U$4.7 66.63,18.08 J4.3
B1
  Top 0.406: 4.95,15.91 J1.1 | 5.02,15.98 J1.1 | U$1.10 11.32,18.55 8.78,16.01 5.05,16.01 J1.1
B1(2)
  Top 0.406: 4.95,37.5 J2.1 | 5.02,37.57 J2.1 | U$2.10 11.32,40.14 8.78,37.6 5.05,37.6 J2.1
B1(3)
  Top 0.406: 67.07,44.27 J3.1 | 66.99,44.19 J3.1 | U$3.10 60.69,41.62 63.23,44.16 66.97,44.16 J3.1
B1(4)
  Top 0.406: 67.07,22.68 J4.1 | 66.99,22.6 J4.1 | U$4.10 60.69,20.03 63.23,22.57 66.97,22.57 J4.1
B2
  Top 0.406: U$1.8 10.03,19.85 8.63,18.45 4.95,18.45 J1.2
B2(2)
  Top 0.406: U$2.8 10.03,41.44 8.63,40.04 4.95,40.04 J2.2
B2(3)
  Top 0.406: U$3.8 61.98,40.32 63.38,41.73 67.07,41.73 J3.2
B2(4)
  Top 0.406: U$4.8 61.98,18.73 63.38,20.14 67.07,20.14 J4.2
BUTTON0
  Top 0.305: OK1.4 43.63,38.41 44.44,37.59 44.44,36.45 R25.1
  Top 0.406: J12.1 13.27,52.37 13.27,55.49 13.65,55.87 44.13,55.87 45.66,54.34 45.66,37.64 R25.1
BUTTON1  (via drill 0.5)
  Top 0.305: OK3.4 39.82,36.75 R27.1 40.18,36.39 v40.18,34.48
  Bottom 0.305: J11.1 47.67,52.52 46.23,51.08 46.23,40.53 v40.18,34.48
  Bottom 0.406: J11.1
BUTTON3
  Top 0.305: IC1.18 35.29,30.04 31.51,33.82 31.51,36.42 R28.1
  Top 0.406: OK4.4 31.69,36.63 R28.1
D0
  Top 0.406: J8.5 38.67,50.91 41.47,48.12 41.47,47.42 R21.1
D1
  Top 0.406: J8.4 36.13,49.9 37.66,48.37 37.66,47.42 R22.1
D2
  Top 0.406: J8.3 33.59,47.17 R23.1
D3
  Top 0.406: J8.2 31.05,49.9 29.53,48.37 29.53,47.17 R24.1
DIR1
  Top 0.305: IC1.23 34.26,27.14 27.63,20.51 27.58,20.51 26.22,19.14 18.6,19.14 U$1.20
DIR2
  Top 0.305: IC1.21 29.23,28.67 24.47,33.43 24.47,41.31 24.16,41.62 20.05,41.62 19.65,41.23 19.65,40.84 19.6,40.79 U$2.20
DIR3
  Top 0.305: U$3.20 52.91,40.97 50.95,39.01 50.95,36.12 44.19,29.37 40.4,29.37 IC1.9
DIR4
  Top 0.305: U$4.20 52.58,19.38 52.36,19.16 52.36,18.85 51.58,18.06 48.05,18.06 46.53,19.58 46.53,23.3 42.89,26.94 40.92,26.94 IC1.7
ENABLE  (via drill 0.3)  (8 unrouted)
  Top 0.305: U$2.14 12.37,36.55 v12,36.18
  Bottom 0.305: v12,36.18 12,36.05
FAULT1
  Top 0.305: U$1.18 22.01,17.9 R3.1
FAULT2
  Top 0.305: U$2.18 20.26,39.49 20.64,39.87 21.89,39.87 R8.1
FAULT3
  Top 0.305: R13.1 51.76,41.65 52.39,42.28 U$3.18
FAULT4
  Top 0.305: R18.1 52.05,20.22 52.52,20.69 U$4.18
GND  (via drill 0.3, 0.5, 0.6)  (12 unrouted)
  Top 0.305: 15.44,18.24 15.46,18.27 | U$1.14 12.37,14.78 v12.42,14.74 | 15.44,39.83 15.46,39.86 | 56.58,41.93 56.55,41.9 | U$3.14 59.64,45.39 v59.6,45.43 | 56.58,20.34 56.55,20.31 | U$4.14 59.64,23.8 v59.6,23.84 | IC1.24 35.54,27.46 35.54,27.96 v35.56,27.98 | IC1.5 39.44,26.54 38.44,27.54 38.44,27.57 v38.83,27.96 | 18.47,41.42 17.69,41.42 | 17.71,19.84 18.47,19.84 19.42,19.84 19.58,20 v20.5,20 | 53.69,40.33 54.31,40.33 54.28,40.3 | 53.54,18.71 54.29,18.71
  Bottom 0.305: v12.42,14.74 12.42,13.93 12.36,13.87 | v59.6,45.43 59.6,46.25 59.65,46.3 | v59.6,23.84 59.6,24.66 59.65,24.71
  other vias: 42.74,41.01 38.93,41.01 30.8,41.01 37.19,29.74 37.16,28.01 37.13,26.41 9.56,31.91 11.69,31.91 9.53,30.09 11.69,30.12 60.12,28.1 60.18,30.17 62.44,30.14 62.44,28.1 30.14,20.43 31.46,21.87 14.71,43.55 16.16,43.58 14.63,41.91 16.12,41.95 14.63,40.23 16.16,40.23 14.67,21.84 16.2,21.84 14.6,20.28 16.12,20.24 14.64,18.75 16.16,18.75 55.75,20.1 57.24,20.13 57.24,18.57 55.79,18.61 55.83,17.01 57.28,17.08 55.83,41.69 57.32,41.69 57.28,40.23 55.83,40.23 55.79,38.74 57.28,38.74
  pour Bottom: 2.18,29.88 24.45,29.95 24.07,0.79 1.8,0.72
  pour Top: 15.87,20.17 15.84,20.17 15.84,29.93 49.14,30.69 49.02,-0.35 15.74,-0.6
  pour Bottom: 2.18,54.51 47.82,54.59 47.82,29.11 2.18,30.05
  pour Top: 15.87,41.76 15.84,41.76 15.84,58.63 49.65,58.63 49.65,30.64 15.87,30.13
  pour Bottom: 73.9,30.17 47.56,30.22 48.07,58.24 74.41,58.19
  pour Top: 56.14,40 56.17,40 56.17,30.24 47.51,30.24 47.64,56.58 56.27,56.58
  pour Bottom: 74.15,-0.57 23.68,-0.9 23.94,31.06 74.41,30.37
  pour Top: 56.14,18.41 56.17,18.41 56.17,-0.49 47.51,-0.49 47.51,30.04 56.14,30.04
MCLR
  Top 0.305: R29.1 46.81,16.37 43.4,19.79 38.18,19.79 34.91,23.06 34.91,25 IC1.26
MCLR'
  Top 0.305: J9.1 39.91,4.43 C25.1 44.26,4.55 R29.2
  Bottom 0.305: R30.1 arc-90 43.65,4.24 J9.1
N$1
  Top 0.305: U$1.3 10.2,23.1 8.71,24.59 8.71,25.64 C3.2
N$2
  Top 0.406: R4.1 16.29,6.72 LED2.A
N$3  (via drill 0.5)
  Top 0.406: U$2.6 8.66,42.74 8.43,42.97
  Top 0.61: 8.43,42.97 8.4,42.97 v8.03,43.34
  Bottom 0.61: v8.03,43.34 8.03,44.6 R6.2
N$5  (via drill 0.5)  (1 unrouted)
  Top 0.406: U$2.9 10.42,40.79 | 10.42,40.76 10.15,40.49 10.15,40.28 9.78,39.91
  Top 0.61: v7.8,38.7 8.58,38.7 9.78,39.91
  Bottom 0.61: R7.2 7.64,37.07 7.77,38.67 v7.8,38.7
N$6  (via drill 0.3)
  Top 0.305: v18.21,35.95 18.21,36.07 18.64,36.51 18.64,37.45 U$2.15
  Bottom 0.305: R10.E 24.32,33.22 24.32,33.23 24.32,35.08 23.75,35.65 18.5,35.65 v18.21,35.95 v18.2,35.95 C8.1
N$7
  Top 0.305: U$2.1 12.37,46.47 12.9,47 12.9,48.13 C7.1
N$8
  Top 0.305: 11.07,48.08 C7.2 10.59,47.72 10.59,46.06 11.3,45.34 U$2.2
N$9  (via drill 0.5)
  Top 0.305: 9.13,21.15 8.74,21.15 8.64,21.25
  Top 0.406: U$1.6 9.13,21.15
  Top 0.61: v8,21.65 8,21.6 8.35,21.25 8.64,21.25
  Bottom 0.406: R1.2 7.88,22.4
  Bottom 0.61: 7.88,22.4 7.88,21.78 v8,21.65
N$10  (via drill 0.5)
  Top 0.406: U$1.9 10.42,19.2 8.25,17.02 v8.25,17
  Bottom 0.406: 8.25,17.02 v8.25,17
  Bottom 0.61: R2.2 8.08,15.81 v8.25,17
N$11  (via drill 0.6)
  Top 0.305: U$1.12 U$1.13 11.22,16.6 10.86,16.24 v10.86,12.31 | 10K.S 18.37,12.29 v18.35,12.31
  Bottom 0.305: v10.86,12.31 v18.35,12.31
N$12
  Top 0.406: R5.1 57.88,6.28 LED3.A
N$14
  Top 0.305: U$2.3 10.2,44.69 8.71,46.18 8.71,47.23 C9.2
N$15  (via drill 0.3)
  Top 0.305: v18.21,14.36 18.21,14.48 18.64,14.92 18.64,15.86 U$1.15
  Bottom 0.305: 10K.E 24.32,11.63 24.32,11.64 24.32,13.56 23.82,14.06 18.5,14.06 v18.21,14.36 v18.2,14.36 C2.1
N$16
  Top 0.305: U$1.1 12.37,24.88 12.9,25.41 12.9,26.54 C1.1
N$17
  Top 0.305: 11.07,26.49 C1.2 10.59,26.13 10.59,24.47 11.3,23.75 U$1.2
N$18  (via drill 0.3)
  Top 0.305: U$2.12 U$2.13 11.44,38.19 v10.43,37.18
  Bottom 0.305: v10.43,37.18 10.43,35.2 11.96,33.67 21.6,33.67 R10.S
N$19  (via drill 0.5)
  Top 0.406: U$3.6 63.64,39.02 63.96,38.7
  Top 0.61: 63.96,38.7 63.96,38.5 v63.99,38.47
  Bottom 0.61: v63.99,38.47 63.99,37.16 R11.2
N$20  (via drill 0.5)
  Top 0.406: U$3.9 61.59,40.97 61.59,41.26
  Top 0.61: 61.59,41.26 63.24,42.91 v63.99,42.91
  Bottom 0.61: R12.2 64.25,44.69 64.25,43.16 v63.99,42.91
N$21  (via drill 0.3)
  Top 0.305: v53.81,45.81 53.81,45.69 53.38,45.26 53.38,44.31 U$3.15
  Bottom 0.305: C14.1 v53.81,45.81 48.67,45.81 47.69,46.8 R15.E
N$22
  Top 0.305: U$3.1 59.64,35.29 59.12,34.77 59.12,33.63 C13.1
N$23
  Top 0.305: 60.95,33.68 C13.2 61.43,34.05 61.43,35.71 60.71,36.42 U$3.2
N$26
  Top 0.305: U$3.3 61.81,37.07 63.31,35.58 63.31,34.54 C15.2
N$27  (via drill 0.3)
  Top 0.305: U$3.12 U$3.13 60.58,43.57 v61.58,44.58
  Bottom 0.305: v61.58,44.58 61.58,46.56 60.05,48.09 50.41,48.09 R15.S
N$28  (via drill 0.5)
  Top 0.406: U$4.6 63.58,17.43 63.88,17.13
  Top 0.61: 63.88,17.13 63.88,17.07 v64.02,16.93
  Bottom 0.61: v64.02,16.93 64.02,15.54 R16.2
N$29  (via drill 0.5)
  Top 0.406: U$4.9 61.59,19.38 61.59,19.6
  Top 0.61: 61.59,19.6 63.3,21.31 63.99,21.31 v64.05,21.37
  Bottom 0.406: 64.25,23.1 R17.2
  Bottom 0.61: v64.05,21.37 64.05,23 R17.2
N$30  (via drill 0.3)
  Top 0.305: v53.81,24.23 53.81,24.1 53.38,23.67 53.38,22.72 U$4.15
  Bottom 0.305: R20.E 47.69,26.95 47.69,25.6 49.06,24.23 v53.81,24.23 v53.81,24.22 C20.1
N$31
  Top 0.305: U$4.1 59.64,13.7 59.12,13.18 59.12,12.04 C19.1
N$32
  Top 0.305: 60.95,12.09 C19.2 61.43,12.45 61.43,14.12 60.71,14.83 U$4.2
N$35
  Top 0.305: U$4.3 61.81,15.48 63.31,13.99 63.31,12.95 C21.2
N$36  (via drill 0.3)
  Top 0.305: U$4.12 U$4.13 60.58,21.98 v61.58,22.99
  Bottom 0.305: v61.58,22.99 61.58,24.97 60.05,26.5 50.41,26.5 R20.S
N$37
  Top 0.406: R23.2 35.56,45.07 OK2.1
N$38
  Top 0.305: 34.86,26.73 34.86,26.78
N$39
  Top 0.305: 39.33,26.7 39.33,26.73
N$40
  Top 0.406: R24.2 31.5,45.2 OK4.1
N$42
  Top 0.305: R33.1 47.89,35.41 LED1.A
N$43
  Top 0.406: R21.2 43.75,47.1 43.75,45.14 OK1.1
N$47
  Top 0.406: R22.2 39.88,45.08 OK3.1
N$48
  Top 0.305: IC1.11 39.11,29.93 40.07,30.89 40.07,31.7 40.59,32.22 40.6,32.22 40.81,32.42 42.02,32.42 42.99,31.45 44.12,31.45 R33.2
PGC1  (via drill 0.6)
  Top 0.305: v39.99,23.5 39.77,23.5 IC1.2
  Bottom 0.305: J9.5 41.32,14.4 43.13,16.21 43.13,18 39.99,21.13 v39.99,23.49 v39.99,23.5
PGD1  (via drill 0.6)  (1 unrouted)
  Top 0.305: IC1.1 38.09,24.26 36.9,23.08 v36.9,23.02
  Bottom 0.305: 39.62,11.86 | J9.4 38.62,11.86 36.63,13.85 36.63,22.75 v36.9,23.02
SCL  (via drill 0.6)
  Top 0.305: v43.29,23.86 43.24,23.86 41.83,25.28 39.83,25.28 IC1.4
  Bottom 0.305: R31.1 53.19,4.3 J10.1 53.13,10.66 46.02,17.78 46.02,21.14 v43.29,23.86
SDA  (via drill 0.5)
  Top 0.305: IC1.3 39.64,24.54 40.88,24.54 42.66,22.76 42.66,22.39 42.6,22.33 v42.6,21.29
  Bottom 0.305: J10.2 50.59,10.77 R32.1 50.42,11.6 44.71,17.31 44.71,19.19 v42.6,21.29
SLEEPALL  (via drill 0.6)  (1 unrouted)
  Top 0.305: 50.15,43.52 51.67,43.52 52.27,42.92 U$3.17 U$3.16 | 50.15,43.52 R13.2 | OK2.4 35.5,36.75 | 50.15,43.52 48.86,43.52 48.83,43.55 48.2,43.55 47.31,42.66 47.31,36.69 43.75,33.13 36.39,33.13 35.81,33.71 R26.1 35.81,33.7 v35.12,33.01 | 24.45,17 v24.45,17.26 24.45,16.37 23.56,15.48 22.04,15.48 R3.2 20.98,15.52 19.9,16.6 U$1.16 U$1.17 | U$2.16 U$2.17 19.78,38.84 20.78,37.84 21.88,37.84 R8.2 21.95,36.91 23.43,35.42 23.43,32.63 22.42,31.61 v22.42,29.07 25.97,25.51 v29.02,25.51 | v48.07,22.09 48.1,22.12 R18.2 50.93,22.14 51.47,22.14 51.47,22.1 52.24,21.33 U$4.17 U$4.16
  Bottom 0.305: v22.42,29.07 22.42,23.86 24.83,21.45 24.83,17.64 v24.45,17.26 | v29.02,25.51 28.89,25.64 28.89,30.98 30.93,33.01 v35.12,33.01 36.01,32.12 36.9,32.12 46.93,22.09 v48.07,22.09
STEP1
  Top 0.305: IC1.22 26.74,20.5 26.68,20.55 21.72,20.55 21.35,20.92 19.78,20.92 19.37,20.5 U$1.22
STEP2
  Top 0.305: U$2.22 19.52,42.09 19.71,42.28 24.47,42.28 25.05,41.7 25.05,33.9 28.74,30.2 34.18,30.2 IC1.19
STEP3
  Top 0.305: IC1.8 44.5,28.5 51.68,35.68 51.68,38.85 52.49,39.66 53.45,39.66 U$3.22
STEP4
  Top 0.305: IC1.6 40.8,26.15 42.39,26.15 45.48,23.06 45.48,19.32 47.57,17.23 51.71,17.23 52.52,18.04 52.55,18.04 52.6,18.09 U$4.22
VDD  (via drill 0.5, 0.6)
  Top 0.305: IC1.10 39.6,29.44 39.6,29.46 40.85,30.71 40.93,30.71 v41.38,31.16 | IC1.25 34.33,25.33 34.32,25.33 34.32,25.31 v33.34,24.33 | v42.76,34.37 42.76,36.23 R25.2 | 28.63,42.65 28.77,42.79
  Top 0.406: 37.15,42.79 40.96,42.79 40.96,38.21 42.55,36.62 R25.2 42.74,36.25 | 37.15,42.79 32.83,42.79 | 32.83,42.79 28.77,42.79 28.01,42.02 28.01,38.21 29.6,36.62 R28.2 | R26.2 33.91,36.88 32.83,37.96 32.83,42.79 | R27.2 38.23,36.88 37.15,37.96 37.15,42.79
  Top 0.61: v26.43,42.65 28.63,42.65 | U1.4 28.05,13.3 v26.53,14.82
  Bottom 0.305: 42.79,32.59 42.79,34.34 v42.76,34.37 | 26.48,42.6 v26.43,42.65 | v26.53,14.82 26.48,14.64 33.34,21.5 v33.34,24.33 32.09,25.58 C31.1 | 48.36,11.15 R32.2 46.95,10.95 44.17,8.16 44.17,6.66 R30.2 arc90 43.74,6.78 J9.2 | 37.28,2.95 47,2.95 48.3,2.22 R31.2 | 42.79,32.59 42.75,32.59 | C30.1 41.69,29.36 41.69,30.84 v41.38,31.16 41.38,31.18 42.79,32.59
  Bottom 0.406: J9.2 38.42,6.78 36.83,5.19 35.88,5.19 33.63,2.95 | 33.63,2.95 32.62,1.93 31.65,1.93 27.39,1.94 26.53,2.79 26.53,6.15 | 37.28,2.95 33.63,2.95
  Bottom 0.61: 26.48,14.64 26.48,42.6 | 26.53,6.15 v26.53,14.82 | C29.1 28.08,13.27 v26.53,14.82
VM  (1 unrouted)
  Top 0.406: 12.69,17.89 13.33,17.89 | 12.85,22.43 13.35,22.43 13.35,22.46 | 12.69,39.48 13.33,39.48 | 12.85,44.02 13.35,44.02 13.35,44.05 | 59.32,42.28 58.68,42.28 | 59.17,37.74 58.66,37.74 58.66,37.71 | 59.32,20.7 58.68,20.7 | 59.17,16.15 58.66,16.15 58.66,16.12
  pour Top: 14.55,-0.81 14.8,30.08 0.71,30 0.2,-0.88
  pour Top: 14.8,30.05 14.93,58.02 1.09,57.94 0.96,29.98
  pour Top: 57.08,58.31 57.21,30.09 74.74,30.04 74.61,58.26
  pour Top: 57.21,30.12 57.72,-0.9 75.5,-0.82 74.99,30.19

### Text on the board
tValues: Sean Michael Ketring